# EAGLE design smd (EAGLE 6.6.0)
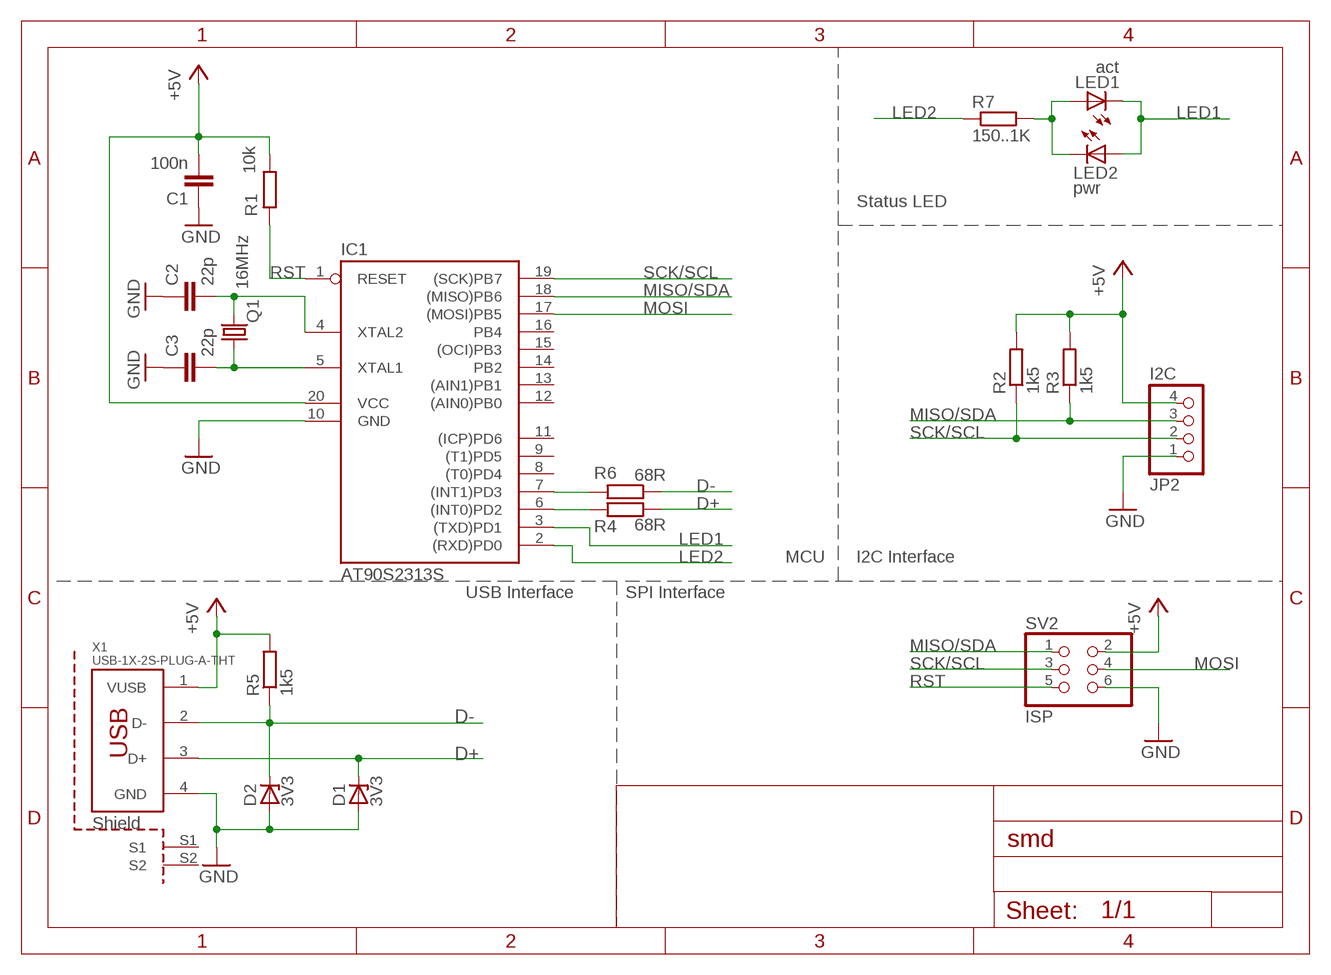
[diagram p0: schematic, sheet 1]

## Parts
C1  100n  C-EUC0805  [C0805]
C2  22p  C-EUC0805  [C0805]
C3  22p  C-EUC0805  [C0805]
D1  3V3  ZENER-DIODESOD80C  [SOD80C]
D2  3V3  ZENER-DIODESOD80C  [SOD80C]
IC1  AT90S2313S  [SO20L]
JP2  I2C  PINHD-1X4  [1X04]
LED1  act  LEDSML0805  [SML0805]
LED2  pwr  LEDSML0805  [SML0805]
Q1  16MHz  CRYTALHC49S  [HC49/S]
R1  10k  R-EU_R0805  [R0805]
R2  1k5  R-EU_R0805  [R0805]
R3  1k5  R-EU_R0805  [R0805]
R4  68R  R-EU_R0805  [R0805]
R5  1k5  R-EU_R0805  [R0805]
R6  68R  R-EU_R0805  [R0805]
R7  150..1K  R-EU_R0805  [R0805]
SV2  ISP  PINHD-2X3  [2X03]
X1  USB-1X-2S-PLUG-A-THT  [USB-PLUG-A-THT-2S]

## Nets
+5V: C1.2 IC1.20(VCC) JP2.4 R1.2 R2.2 R3.2 R5.2 SV2.2 X1.1(VUSB)
AVRD+: IC1.6((INT0)PD2) R4.2
AVRD-: IC1.7((INT1)PD3) R6.2
D+: D1.C R4.1 X1.3(D+)
D-: D2.C R5.1 R6.1 X1.2(D-)
GND: C1.1 C2.1 C3.1 D1.A D2.A IC1.10(GND) JP2.1 SV2.6 X1.4(GND)
LED1: IC1.3((TXD)PD1) LED1.C LED2.A
LED2: IC1.2((RXD)PD0) R7.1
MISO/SDA: IC1.18((MISO)PB6) JP2.3 R3.1 SV2.1
MOSI: IC1.17((MOSI)PB5) SV2.4
N$2: LED1.A LED2.C R7.2
N$37: C3.2 IC1.5(XTAL1) Q1.1
N$38: C2.2 IC1.4(XTAL2) Q1.2
RST: IC1.1(RESET) R1.1 SV2.5
SCK/SCL: IC1.19((SCK)PB7) JP2.2 R2.1 SV2.3
Unconnected: IC1.8((T0)PD4) IC1.9((T1)PD5) IC1.11((ICP)PD6) IC1.12((AIN0)PB0) IC1.13((AIN1)PB1) IC1.14(PB2) IC1.15((OCI)PB3) IC1.16(PB4) X1.S1 X1.S2

## Notes on the sheet
- Status LED
- MCU | I2C Interface
- USB Interface | SPI Interface

## Library data of the parts
C1-C3 = rcl:C-EU: CAPACITOR, European symbol
D1 D2 = diode:ZENER-DIODE: Z-Diode
IC1 = atmel:AT90S2313: MICROCONTROLLER 2 Kbytes FLASH 128 bytes SRAM 128 bytes EEPROM UART; OC_FARNELL: unknown; OC_NEWARK: unknown
JP2 = pinhead:PINHD-1X4: PIN HEADER
LED1 LED2 = led:LED: LED OSRAM: - CHIPLED LG R971, LG N971, LY N971, LG Q971, LY Q971, LO R971, LY R971 LH N974, LH R974 LS Q976, LO Q976, LY Q976 LO Q996 - Hyper CHIPLED LW Q18S LB Q993, LB Q99A, LB R99A - SideLED LS A670, LO A670, LY A670, LG A670, LP A670 LB A673, LV A673, LT A673, LW A673 LH A674 LY A675 LS A676, LA A676, LO A676, LY A676, LW A676 LS A679, LY A679, LG A679 - Hyper Micro SIDELED® LS Y876, LA Y876, LO Y876, LY Y876 LT Y87S - SmartLED LW L88C, LW L88S LB L89C, LB L89S, LG L890 LS L89K, LO L89K, LY L89K LS L896, LA L896, LO L896, LY L896 - TOPLED LS T670, LO T670, LY T670, LG T670, LP T670 LSG T670, LSP T670, LSY T670, LOP T670, LYG T670 LG T671, LOG T671, LSG T671 LB T673, LV T673, LT T673, LW T673 LH T674 LS T676, LA T676, LO T676, LY T676, LB T676, LH T676, LSB T676, LW T676 LB T67C, LV T67C, LT T67C, LS T67K, LO T67K, LY T67K, LW E67C LS E67B, LA E67B, LO E67B, LY E67B, LB E67C, LV E67C, LT E67C LW T67C LS T679, LY T679, LG T679 LS T770, LO T770, LY T770, LG T770, LP T770 LB T773, LV T773, LT T773, LW T773 LH T774 LS E675, LA E675, LY E675, LS T675 LS T776, LA T776, LO T776, LY T776, LB T776 LHGB T686 LT T68C, LB T68C - Hyper Mini TOPLED® LB M676 - Mini TOPLED Santana® LG M470 LS M47K, LO M47K, LY M47K Source: http://www.osram.convergy.de LUXEON: - LUMILED® LXK2-PW12-R00, LXK2-PW12-S00, LXK2-PW14-U00, LXK2-PW14-V00 LXK2-PM12-R00, LXK2-PM12-S00, LXK2-PM14-U00 LXK2-PE12-Q00, LXK2-PE12-R00, LXK2-PE12-S00, LXK2-PE14-T00, LXK2-PE14-U00 LXK2-PB12-K00, LXK2-PB12-L00, LXK2-PB12-M00, LXK2-PB14-N00, LXK2-PB14-P00, LXK2-PB14-Q00 LXK2-PR12-L00, LXK2-PR12-M00, LXK2-PR14-Q00, LXK2-PR14-R00 LXK2-PD12-Q00, LXK2-PD12-R00, LXK2-PD12-S00 LXK2-PH12-R00, LXK2-PH12-S00 LXK2-PL12-P00, LXK2-PL12-Q00, LXK2-PL12-R00 Source: www.luxeon.com KINGBRIGHT: KA-3528ASYC Source: www.kingbright.com
Q1 = crystal:CRYTAL: CRYSTAL
R1-R7 = rcl:R-EU_: RESISTOR, European symbol
SV2 = pinhead:PINHD-2X3: PIN HEADER
X1 = _con-usb_1:USB-1X-2S

## Board
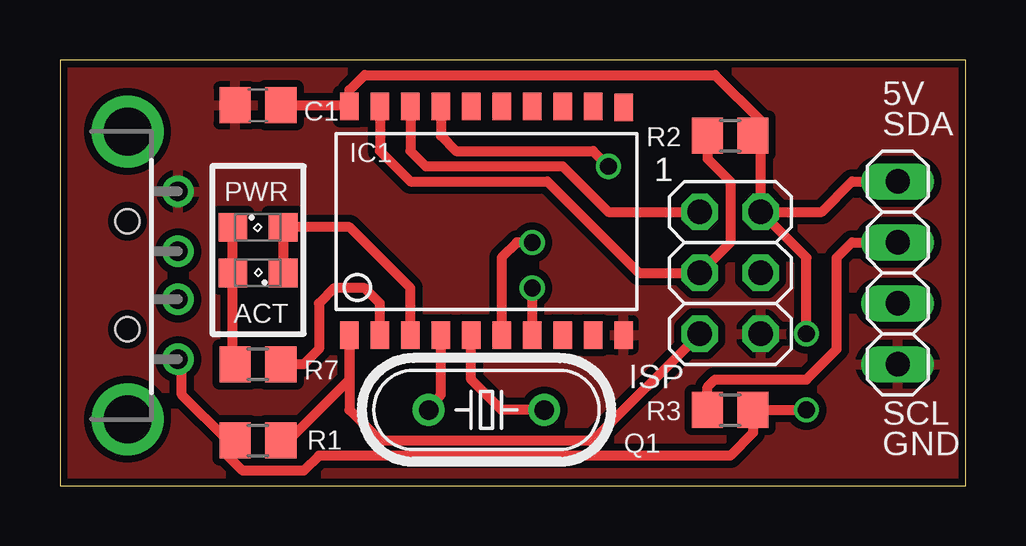
[diagram p1: board, top side]
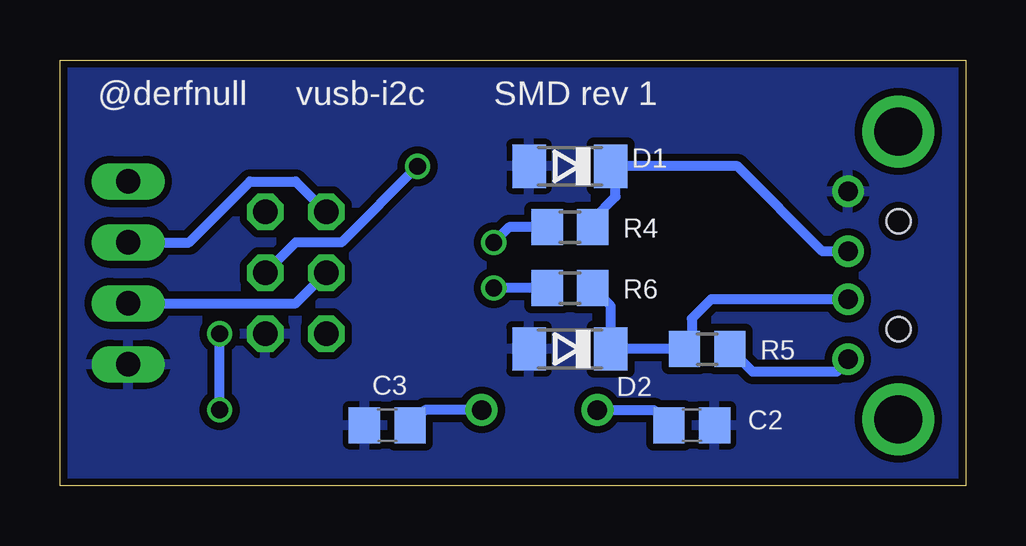
[diagram p2: board, bottom side, seen from below]

Size 37.77 x 17.77 mm. Coordinates in mm from the lower left corner, seen from the top.
Outline: 0,0 37.77,0 37.77,17.77 0,17.77 0,0
Copper layers (1*16): Top 0.035mm / dielectric 1.5mm / Bottom 0.035mm
Design rules "dirtypcbs_v1 *": minimum track width 5mil, minimum drill 12mil, track to track 5mil, track to pad 5mil, pad to pad 5mil, via to via 5mil, smd to smd 0mil, copper to edge 10mil, drill to drill 10mil, minimum pad ring 10mil, minimum via ring 6mil, stop-mask expansion 2mil, vias tented up to drill 25mil, thermal gap 10mil

### Footprints (pad centres in the part's own frame; a part is rotated, then mirrored left to right if it is on the bottom)
C0805 = smd 1.3 x 1.5: 1 -0.95,0; 2 0.95,0
SOD80C = smd 1.4 x 1.8: A 1.7,0; C -1.7,0
SO20L = smd 0.762 x 1.143: 1 -5.08,-5.131; 2 -3.81,-5.131; 3 -2.54,-5.131; 4 -1.27,-5.131; 5 0,-5.131; 6 1.27,-5.131; 7 2.54,-5.131; 8 3.81,-5.131; 9 5.08,-5.131; 10 6.35,-5.131; 11 6.35,4.369; 12 5.08,4.394; 13 3.81,4.394; 14 2.54,4.394; 15 1.27,4.394; 16 0,4.394; 17 -1.27,4.394; 18 -2.54,4.394; 19 -3.81,4.394; 20 -5.08,4.394
1X04 = drill 1.016 long: 1 -3.81,0; 2 -1.27,0; 3 1.27,0; 4 3.81,0
SML0805 = smd 1.2 x 1.2: A 1.05,0; C -1.05,0
HC49/S = drill 0.813: 1 -2.413,0; 2 2.413,0
R0805 = smd 1.3 x 1.5: 1 -0.95,0; 2 0.95,0
2X03 = drill 1.016 octagon: 1 -2.54,-1.27; 2 -2.54,1.27; 3 0,-1.27; 4 0,1.27; 5 2.54,-1.27; 6 2.54,1.27
USB-PLUG-A-THT-2S = drill 0.8: 1 10,-3.6; 2 10,-1.1; 3 10,0.9; 4 10,3.4 | drill 2: S1 7.9,-6.1; S2 7.9,5.9 | hole 1: 7.9,-2.35; 7.9,2.15

### Placement (x,y rotation side)
C1  8.26,15.88 0 top
C2  11.43,2.54 180 bottom
C3  24.13,2.54 0 bottom
D1  16.51,13.34 180 bottom
D2  16.51,5.71 180 bottom
IC1  17.14,11.43 0 top
JP2  34.92,8.89 90 top
LED1  8.26,8.89 180 top
LED2  8.26,10.79 0 top
Q1  17.78,3.17 180 top
R1  8.26,1.91 180 top
R2  27.94,14.61 0 top
R3  27.94,3.17 0 top
R4  16.51,10.79 180 bottom
R5  10.79,5.71 0 bottom
R6  16.51,8.26 180 bottom
R7  8.26,5.08 180 top
SV2  27.94,8.89 270 top
X1  -5.08,8.89 0 top

### Tracks (layer width: path | path; a pad name or v marks a point on that pad's centre or on a via)
+5V  (via drill 0.7)
  Top 0.406: IC1.20 12.01,15.88 C1.2 12.06,15.88 12.06,16.51 12.7,17.14 27.3,17.14 29.21,15.24 29.21,14.93 R2.2 29.21,14.29 SV2.2 | SV2.2 31.75,11.43 33.02,12.7 JP2.4 | v31.11,3.17 R3.2 28.89,2.22 27.94,1.27 10.79,1.27 10.16,0.64 7.62,0.64 6.99,1.27 6.99,1.58 R1.2 6.99,1.91 5.08,3.81 5.08,5.13 X1.1 | v31.11,6.35 31.11,9.53 SV2.2
  Bottom 0.406: X1.1 5.08,5.13 5.08,5.08 5.39,4.76 8.89,4.76 R5.2 | v31.11,3.17 v31.11,6.35
AVRD+  (via drill 0.7)
  Top 0.406: v19.68,10.16 19.05,10.16 18.41,9.53 IC1.6
  Bottom 0.406: R4.2 19.05,10.79 v19.68,10.16
AVRD-  (via drill 0.7)
  Top 0.406: v19.68,8.26 IC1.7
  Bottom 0.406: R6.2 v19.68,8.26
D+
  Bottom 0.406: X1.3 5.98,9.79 9.53,13.34 D1.C 14.61,13.13 14.61,12.06 15.56,11.11 R4.1
D-
  Bottom 0.406: X1.2 10.62,7.79 11.43,6.99 11.43,6.03 R5.1 D2.C 14.81,7.5 R6.1
GND
  pour Top (isolate 0.305): 0,17.78 38.1,17.78 38.1,0 0,0
  pour Bottom (isolate 0.305): 0,17.78 38.1,17.78 38.1,0 0,0
LED1
  Top 0.406: LED1.C LED2.A 12.06,10.79 14.61,8.26 IC1.3
LED2
  Top 0.406: IC1.2 13.34,7.62 12.7,8.26 11.43,8.26 10.79,7.62 10.79,5.71 10.16,5.08 R7.1
MISO/SDA
  Top 0.406: IC1.18 14.61,13.97 15.24,13.34 20.95,13.34 22.86,11.43 SV2.1 | R3.1 26.99,4.13 27.3,4.45 31.11,4.45 32.38,5.71 32.38,9.53 33.02,10.16 JP2.3
  Bottom 0.406: JP2.3 32.38,10.16 29.84,12.7 27.94,12.7 SV2.1
MOSI  (via drill 0.7)
  Top 0.406: IC1.17 15.88,14.61 16.51,13.97 22.23,13.97 v22.86,13.34
  Bottom 0.406: v22.86,13.34 26.04,10.16 27.94,10.16 SV2.4
N$2
  Top 0.406: LED2.C LED1.A 7.21,5.08 R7.2
N$37
  Top 0.406: Q1.1 18.41,3.17 17.14,4.45 IC1.5
  Bottom 0.406: Q1.1 22.55,3.17 C3.2
N$38
  Top 0.406: Q1.2 15.37,3.3 15.88,3.81 IC1.4
  Bottom 0.406: Q1.2 13.02,3.17 C2.2
RST
  Top 0.406: R1.1 9.53,1.91 12.06,4.45 IC1.1 12.06,3.17 13.34,1.91 22.23,1.91 SV2.5
SCK/SCL
  Top 0.406: IC1.19 13.34,13.97 14.61,12.7 20.32,12.7 24.13,8.89 SV2.3 27.94,10.16 27.94,12.7 26.99,13.65 R2.1
  Bottom 0.406: JP2.2 27.94,7.62 SV2.3

### Text on the board
tNames: 5V | SDA | PWR | 1 | ACT | ISP | SCL | GND
bNames: SMD rev 1 | vusb-i2c | @derfnull